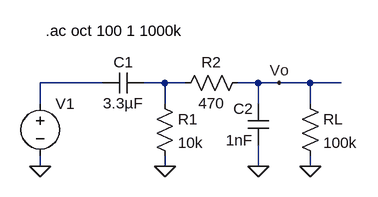
[diagram p0: schematic codec-output-buffer.asc]
codec-output-buffer.asc, the LTspice schematic file:
Version 4
SHEET 1 880 680
WIRE 320 208 224 208
WIRE 416 208 384 208
WIRE 448 208 416 208
WIRE 560 208 528 208
WIRE 592 208 560 208
WIRE 640 208 592 208
WIRE 688 208 640 208
WIRE 224 240 224 208
WIRE 416 240 416 208
WIRE 560 240 560 208
WIRE 640 240 640 208
WIRE 224 336 224 320
WIRE 416 336 416 320
WIRE 560 336 560 304
WIRE 640 336 640 320
FLAG 224 336 0
FLAG 416 336 0
FLAG 560 336 0
FLAG 592 208 Vo
FLAG 640 336 0
SYMBOL voltage 224 224 R0
SYMATTR InstName V1
SYMATTR Value ""
SYMATTR Value2 AC 1
SYMBOL cap 384 192 R90
WINDOW 0 0 32 VBottom 2
WINDOW 3 32 32 VTop 2
SYMATTR InstName C1
SYMATTR Value 3.3µF
SYMBOL cap 576 304 R180
WINDOW 0 24 56 Left 2
WINDOW 3 24 8 Left 2
SYMATTR InstName C2
SYMATTR Value 1nF
SYMBOL res 400 224 R0
SYMATTR InstName R1
SYMATTR Value 10k
SYMBOL res 544 192 R90
WINDOW 0 0 56 VBottom 2
WINDOW 3 32 56 VTop 2
SYMATTR InstName R2
SYMATTR Value 470
SYMBOL res 624 224 R0
SYMATTR InstName RL
SYMATTR Value 100k
TEXT 232 128 Left 2 !.ac oct 100 1 1000k

The netlist it stands for:
* codec-output-buffer.asc
V1 N001 0 AC 1
C1 N002 N001 3.3µF
C2 0 Vo 1nF
R1 N002 0 10k
R2 Vo N002 470
RL Vo 0 100k
.ac oct 100 1 1000k
.backanno
.end